# EAGLE schematic WemosD1_Mini_SMD1206 (EAGLE 9.6.2)
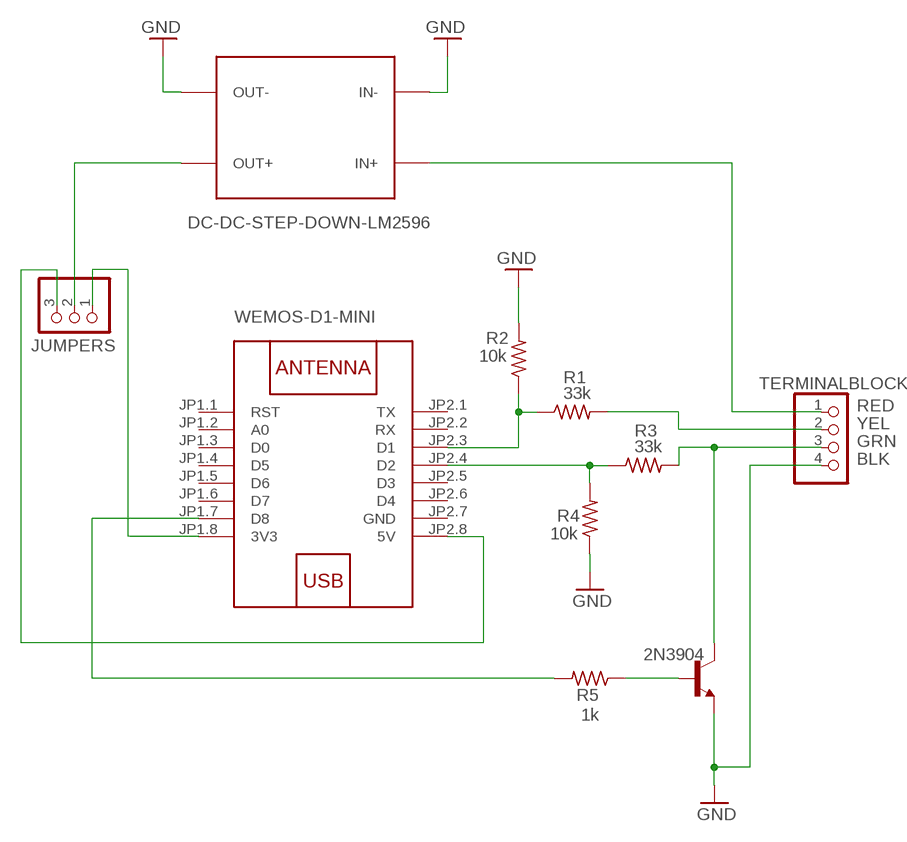
[diagram p0: schematic, sheet 1]

## Parts
JUMPERS  PINHD-1X3  [1X03]
R1  33k  R-US_R1206  [R1206]
R2  10k  R-US_R1206  [R1206]
R3  33k  R-US_R1206  [R1206]
R4  10k  R-US_R1206  [R1206]
R5  1k  R-US_R1206  [R1206]
T1  2N3904  [TO92]
TERMINALBLOCK  PINHD-1X4  [1X04]
U$1  WEMOS-D1-MINI  [WEMOS-D1-MINI]
U$2  DC-DC-STEP-DOWN-LM2596  [DC-DC-STEP-DOWN-LM2596]

## Nets
GND: R2.2 R4.1 T1.3(E) TERMINALBLOCK.4 U$2.IN- U$2.OUT-
N$1: R1.1 R2.1 U$1.JP2.3(D1)
N$2: R1.2 TERMINALBLOCK.2
N$3: R3.1 R4.2 U$1.JP2.4(D2)
N$4: R3.2 T1.1(C) TERMINALBLOCK.3
N$5: TERMINALBLOCK.1 U$2.IN+
N$6: JUMPERS.2 U$2.OUT+
N$7: R5.1 T1.2(B)
N$8: R5.2 U$1.JP1.7(D8)
N$9: JUMPERS.3 U$1.JP2.8(5V)
N$10: JUMPERS.1 U$1.JP1.8(3V3)
Unconnected: U$1.JP1.1(RST) U$1.JP1.2(A0) U$1.JP1.3(D0) U$1.JP1.4(D5) U$1.JP1.5(D6) U$1.JP1.6(D7) U$1.JP2.1(TX) U$1.JP2.2(RX) U$1.JP2.5(D3) U$1.JP2.6(D4)

## Notes on the sheet
- RED
- YEL
- GRN
- BLK

## Power pins joined to a net without a drawn wire
GND: U$1.JP2.7(GND)

## Library data of the parts
JUMPERS = pinheadDSC1:PINHD-1X3: PIN HEADER
R1-R5 = rcl:R-US_: RESISTOR, American symbol; SPICEPREFIX: R
T1 = transistor:2N3904: NPN TRANSISTOR
TERMINALBLOCK = pinhead:PINHD-1X4: PIN HEADER
U$1 = diy-modules:WEMOS-D1-MINI: WEMOS D1 mini: Mini Wi-Fi Board based on ESP-8266 device More details can be found here: https://www.wemos.cc/product/d1-mini.html Click here to find device on ebay.com <http://www.ebay.com/sch/wemos+d1+mini+nodemcu>
U$2 = diy-modules:DC-DC-STEP-DOWN-LM2596: DC/DC Step-Down Regulator based on LM2596-ADJ chip LM2596 datasheet available here: http://www.ti.com/lit/ds/symlink/lm2596.pdf Click here to find device on ebay.com <http://www.ebay.com/sch/lm2596+power+regulator>